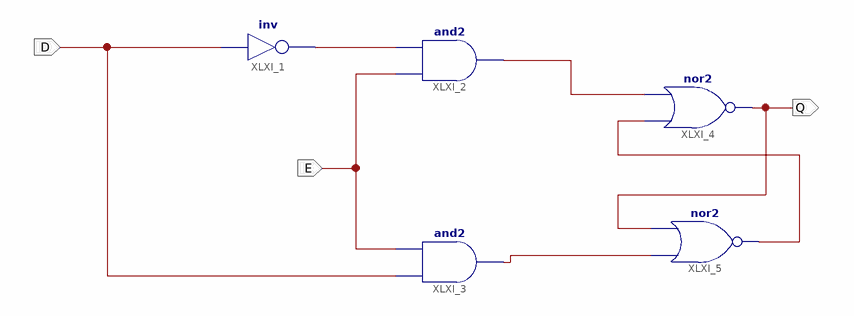
[diagram p0: schematic sheet 1]
// Xilinx ISE schematic dlatch.sch (spartan6) as structural Verilog: 5 symbols, 3 ports
module dlatch (
  input  D,
  input  E,
  output Q
);

  wire XLXN_2, XLXN_4, XLXN_8, XLXN_19;

  not XLXI_1 (XLXN_2, D);
  and XLXI_2 (XLXN_4, E, XLXN_2);
  and XLXI_3 (XLXN_8, D, E);
  nor XLXI_4 (Q, XLXN_19, XLXN_4);
  nor XLXI_5 (XLXN_19, XLXN_8, Q);
endmodule
